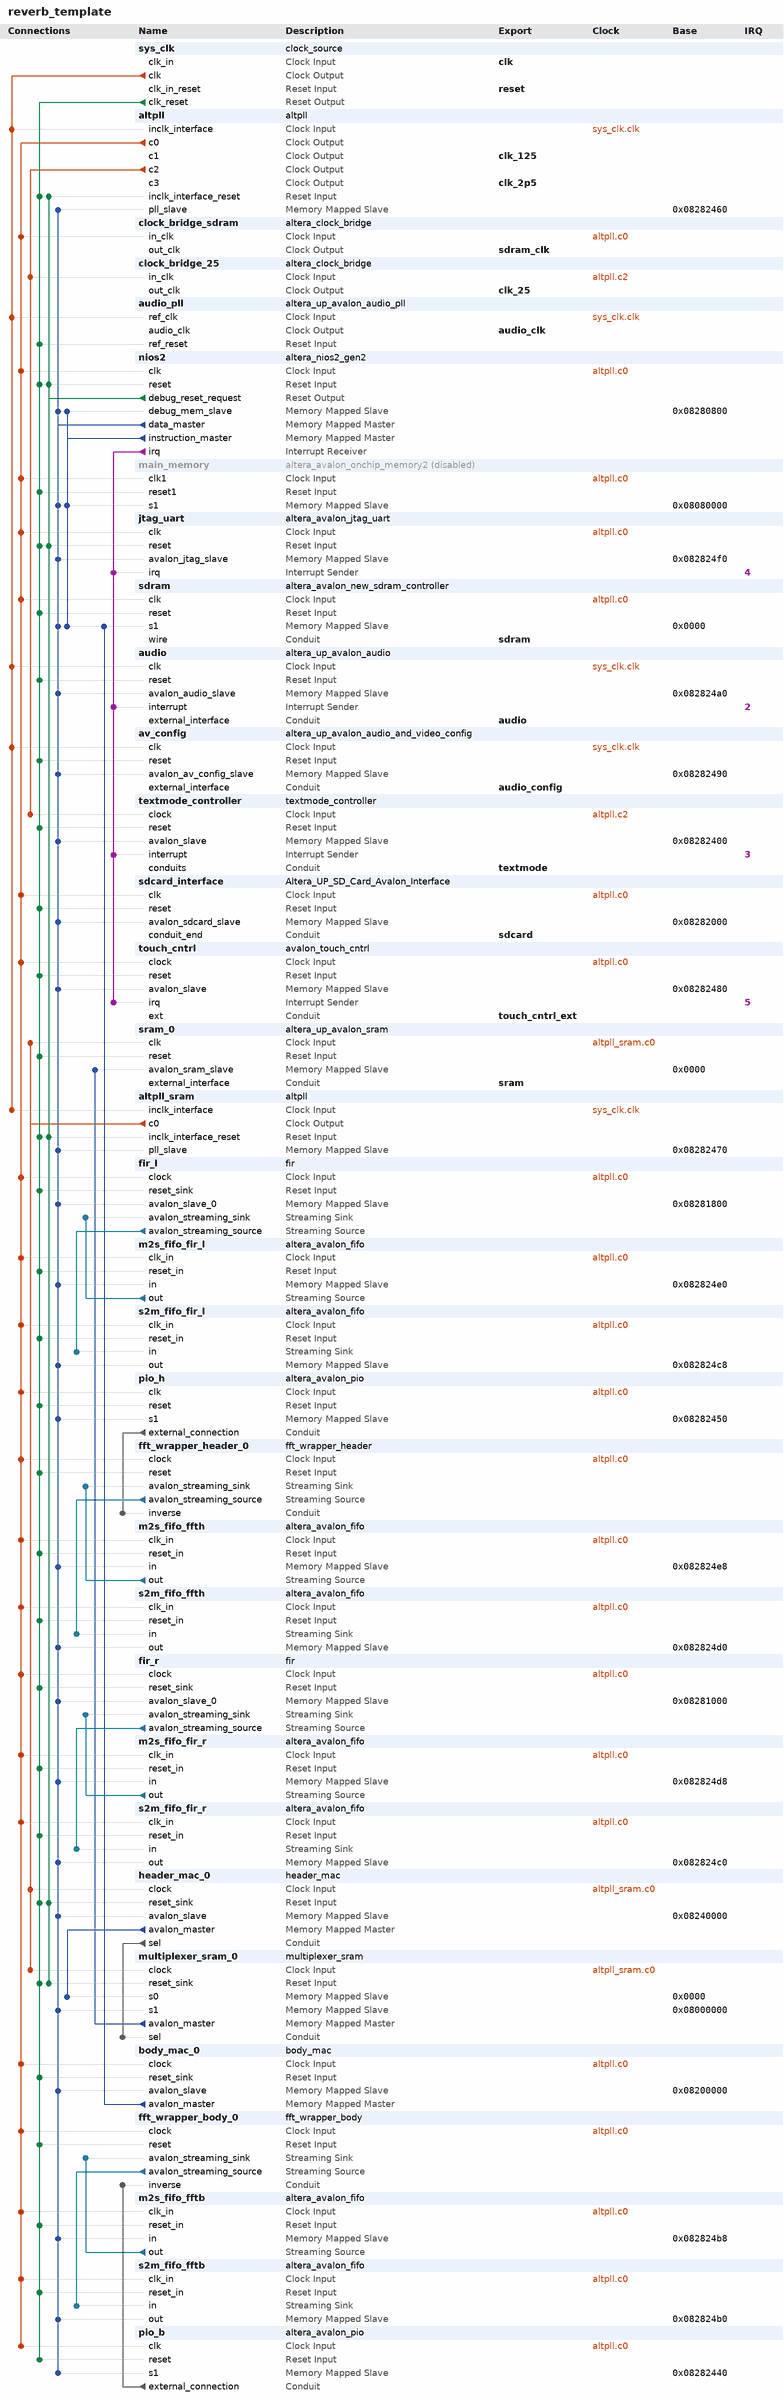
[diagram p0: system contents]
# Platform Designer (Qsys) system reverb_template, Cyclone IV E EP4CE115F29C7
# Parameters at their usual value, and those the tool derives, are not listed.
package require -exact qsys 18.1
create_system reverb_template
set_project_property DEVICE_FAMILY {Cyclone IV E}
set_project_property DEVICE EP4CE115F29C7

add_instance sys_clk clock_source 18.1
set_instance_parameter_value sys_clk clockFrequency 50000000

add_instance altpll altpll 18.1
set_instance_parameter_value altpll CLK0_DIVIDE_BY 1
set_instance_parameter_value altpll CLK0_MULTIPLY_BY 2
set_instance_parameter_value altpll CLK1_DIVIDE_BY 2
set_instance_parameter_value altpll CLK1_DUTY_CYCLE 50
set_instance_parameter_value altpll CLK1_MULTIPLY_BY 5
set_instance_parameter_value altpll CLK1_PHASE_SHIFT 0
set_instance_parameter_value altpll CLK2_DIVIDE_BY 2
set_instance_parameter_value altpll CLK2_DUTY_CYCLE 50
set_instance_parameter_value altpll CLK2_MULTIPLY_BY 1
set_instance_parameter_value altpll CLK2_PHASE_SHIFT 0
set_instance_parameter_value altpll CLK3_DIVIDE_BY 20
set_instance_parameter_value altpll CLK3_DUTY_CYCLE 50
set_instance_parameter_value altpll CLK3_MULTIPLY_BY 1
set_instance_parameter_value altpll CLK3_PHASE_SHIFT 0
set_instance_parameter_value altpll INCLK0_INPUT_FREQUENCY 20000
set_instance_parameter_value altpll PORT_ARESET PORT_UNUSED
set_instance_parameter_value altpll PORT_LOCKED PORT_UNUSED
set_instance_parameter_value altpll PORT_clk1 PORT_USED
set_instance_parameter_value altpll PORT_clk2 PORT_USED
set_instance_parameter_value altpll PORT_clk3 PORT_USED

add_instance clock_bridge_sdram altera_clock_bridge 18.1
set_instance_parameter_value clock_bridge_sdram DERIVED_CLOCK_RATE 100000000
set_instance_parameter_value clock_bridge_sdram EXPLICIT_CLOCK_RATE 0

add_instance clock_bridge_25 altera_clock_bridge 18.1
set_instance_parameter_value clock_bridge_25 DERIVED_CLOCK_RATE 25000000
set_instance_parameter_value clock_bridge_25 EXPLICIT_CLOCK_RATE 0

add_instance audio_pll altera_up_avalon_audio_pll 18.0
set_instance_parameter_value audio_pll gui_refclk 50.0

add_instance nios2 altera_nios2_gen2 18.1
set_instance_parameter_value nios2 dcache_size 0
set_instance_parameter_value nios2 exceptionSlave sdram.s1
set_instance_parameter_value nios2 icache_size 2048
set_instance_parameter_value nios2 impl Fast
set_instance_parameter_value nios2 resetSlave sdram.s1
set_instance_parameter_value nios2 resetrequest_enabled false

add_instance main_memory altera_avalon_onchip_memory2 18.1
set_instance_property main_memory ENABLED false
set_instance_parameter_value main_memory dataWidth 32
set_instance_parameter_value main_memory dualPort false
set_instance_parameter_value main_memory initMemContent true
set_instance_parameter_value main_memory initializationFileName onchip_mem.hex
set_instance_parameter_value main_memory memorySize 407200

add_instance jtag_uart altera_avalon_jtag_uart 18.1
set_instance_parameter_value jtag_uart simInteractiveOptions NO_INTERACTIVE_WINDOWS

add_instance sdram altera_avalon_new_sdram_controller 18.1
set_instance_parameter_value sdram TAC 5.5
set_instance_parameter_value sdram TRCD 20.0
set_instance_parameter_value sdram TRP 20.0
set_instance_parameter_value sdram casLatency 3
set_instance_parameter_value sdram columnWidth 10
set_instance_parameter_value sdram dataWidth 32
set_instance_parameter_value sdram generateSimulationModel true
set_instance_parameter_value sdram model single_Micron_MT48LC4M32B2_7_chip
set_instance_parameter_value sdram numberOfBanks 4
set_instance_parameter_value sdram numberOfChipSelects 1
set_instance_parameter_value sdram powerUpDelay 100.0
set_instance_parameter_value sdram refreshPeriod 15.625
set_instance_parameter_value sdram rowWidth 13

add_instance audio altera_up_avalon_audio 18.0
set_instance_parameter_value audio audio_in true
set_instance_parameter_value audio avalon_bus_type {Memory Mapped}
set_instance_parameter_value audio dw 32

add_instance av_config altera_up_avalon_audio_and_video_config 18.0
set_instance_parameter_value av_config audio_in {Line In to ADC}
set_instance_parameter_value av_config bit_length 24
set_instance_parameter_value av_config board DE2-115
set_instance_parameter_value av_config line_in_bypass false
set_instance_parameter_value av_config sampling_rate {48 kHz}

add_instance textmode_controller textmode_controller 1.0
set_instance_parameter_value textmode_controller CLK_FREQ 25000000
set_instance_parameter_value textmode_controller COLUMN_COUNT 100
set_instance_parameter_value textmode_controller ROW_COUNT 30

add_instance sdcard_interface Altera_UP_SD_Card_Avalon_Interface 18.0

add_instance touch_cntrl avalon_touch_cntrl 1.0
set_instance_parameter_value touch_cntrl SYS_CLK 100000000

add_instance sram_0 altera_up_avalon_sram 18.0
set_instance_parameter_value sram_0 board DE2-115
set_instance_parameter_value sram_0 pixel_buffer false

add_instance altpll_sram altpll 18.1
set_instance_parameter_value altpll_sram CLK0_DIVIDE_BY 2
set_instance_parameter_value altpll_sram CLK0_MULTIPLY_BY 3
set_instance_parameter_value altpll_sram INCLK0_INPUT_FREQUENCY 20000
set_instance_parameter_value altpll_sram PORT_ARESET PORT_UNUSED
set_instance_parameter_value altpll_sram PORT_LOCKED PORT_UNUSED
set_instance_parameter_value altpll_sram PORT_clk1 PORT_UNUSED
set_instance_parameter_value altpll_sram PORT_clk2 PORT_UNUSED
set_instance_parameter_value altpll_sram PORT_clk3 PORT_UNUSED

add_instance fir_l fir 1.0
set_instance_parameter_value fir_l ADDR_WIDTH 9
set_instance_parameter_value fir_l DATA_WIDTH 32
set_instance_parameter_value fir_l NUM_COEFFICIENTS 512

add_instance m2s_fifo_fir_l altera_avalon_fifo 18.1
set_instance_parameter_value m2s_fifo_fir_l bitsPerSymbol 32
set_instance_parameter_value m2s_fifo_fir_l channelWidth 0
set_instance_parameter_value m2s_fifo_fir_l errorWidth 0
set_instance_parameter_value m2s_fifo_fir_l fifoDepth 32
set_instance_parameter_value m2s_fifo_fir_l fifoInputInterfaceOptions AVALONMM_WRITE
set_instance_parameter_value m2s_fifo_fir_l fifoOutputInterfaceOptions AVALONST_SOURCE
set_instance_parameter_value m2s_fifo_fir_l singleClockMode true
set_instance_parameter_value m2s_fifo_fir_l symbolsPerBeat 1
set_instance_parameter_value m2s_fifo_fir_l useIRQ false
set_instance_parameter_value m2s_fifo_fir_l usePacket false
set_instance_parameter_value m2s_fifo_fir_l useReadControl false
set_instance_parameter_value m2s_fifo_fir_l useRegister true
set_instance_parameter_value m2s_fifo_fir_l useWriteControl false

add_instance s2m_fifo_fir_l altera_avalon_fifo 18.1
set_instance_parameter_value s2m_fifo_fir_l bitsPerSymbol 32
set_instance_parameter_value s2m_fifo_fir_l channelWidth 0
set_instance_parameter_value s2m_fifo_fir_l errorWidth 0
set_instance_parameter_value s2m_fifo_fir_l fifoDepth 32
set_instance_parameter_value s2m_fifo_fir_l fifoInputInterfaceOptions AVALONST_SINK
set_instance_parameter_value s2m_fifo_fir_l fifoOutputInterfaceOptions AVALONMM_READ
set_instance_parameter_value s2m_fifo_fir_l singleClockMode true
set_instance_parameter_value s2m_fifo_fir_l symbolsPerBeat 1
set_instance_parameter_value s2m_fifo_fir_l useIRQ false
set_instance_parameter_value s2m_fifo_fir_l usePacket false
set_instance_parameter_value s2m_fifo_fir_l useReadControl false
set_instance_parameter_value s2m_fifo_fir_l useRegister true
set_instance_parameter_value s2m_fifo_fir_l useWriteControl false

add_instance pio_h altera_avalon_pio 18.1
set_instance_parameter_value pio_h direction Output
set_instance_parameter_value pio_h width 1

add_instance fft_wrapper_header_0 fft_wrapper_header 1.0

add_instance m2s_fifo_ffth altera_avalon_fifo 18.1
set_instance_parameter_value m2s_fifo_ffth bitsPerSymbol 32
set_instance_parameter_value m2s_fifo_ffth channelWidth 0
set_instance_parameter_value m2s_fifo_ffth errorWidth 0
set_instance_parameter_value m2s_fifo_ffth fifoDepth 64
set_instance_parameter_value m2s_fifo_ffth fifoInputInterfaceOptions AVALONMM_WRITE
set_instance_parameter_value m2s_fifo_ffth fifoOutputInterfaceOptions AVALONST_SOURCE
set_instance_parameter_value m2s_fifo_ffth singleClockMode true
set_instance_parameter_value m2s_fifo_ffth symbolsPerBeat 1
set_instance_parameter_value m2s_fifo_ffth useIRQ false
set_instance_parameter_value m2s_fifo_ffth usePacket false
set_instance_parameter_value m2s_fifo_ffth useReadControl false
set_instance_parameter_value m2s_fifo_ffth useRegister true
set_instance_parameter_value m2s_fifo_ffth useWriteControl false

add_instance s2m_fifo_ffth altera_avalon_fifo 18.1
set_instance_parameter_value s2m_fifo_ffth bitsPerSymbol 32
set_instance_parameter_value s2m_fifo_ffth channelWidth 0
set_instance_parameter_value s2m_fifo_ffth errorWidth 0
set_instance_parameter_value s2m_fifo_ffth fifoDepth 64
set_instance_parameter_value s2m_fifo_ffth fifoInputInterfaceOptions AVALONST_SINK
set_instance_parameter_value s2m_fifo_ffth fifoOutputInterfaceOptions AVALONMM_READ
set_instance_parameter_value s2m_fifo_ffth singleClockMode true
set_instance_parameter_value s2m_fifo_ffth symbolsPerBeat 1
set_instance_parameter_value s2m_fifo_ffth useIRQ false
set_instance_parameter_value s2m_fifo_ffth usePacket false
set_instance_parameter_value s2m_fifo_ffth useReadControl false
set_instance_parameter_value s2m_fifo_ffth useRegister true
set_instance_parameter_value s2m_fifo_ffth useWriteControl false

add_instance fir_r fir 1.0
set_instance_parameter_value fir_r ADDR_WIDTH 9
set_instance_parameter_value fir_r DATA_WIDTH 32
set_instance_parameter_value fir_r NUM_COEFFICIENTS 512

add_instance m2s_fifo_fir_r altera_avalon_fifo 18.1
set_instance_parameter_value m2s_fifo_fir_r bitsPerSymbol 32
set_instance_parameter_value m2s_fifo_fir_r channelWidth 0
set_instance_parameter_value m2s_fifo_fir_r errorWidth 0
set_instance_parameter_value m2s_fifo_fir_r fifoDepth 32
set_instance_parameter_value m2s_fifo_fir_r fifoInputInterfaceOptions AVALONMM_WRITE
set_instance_parameter_value m2s_fifo_fir_r fifoOutputInterfaceOptions AVALONST_SOURCE
set_instance_parameter_value m2s_fifo_fir_r singleClockMode true
set_instance_parameter_value m2s_fifo_fir_r symbolsPerBeat 1
set_instance_parameter_value m2s_fifo_fir_r useIRQ false
set_instance_parameter_value m2s_fifo_fir_r usePacket false
set_instance_parameter_value m2s_fifo_fir_r useReadControl false
set_instance_parameter_value m2s_fifo_fir_r useRegister true
set_instance_parameter_value m2s_fifo_fir_r useWriteControl false

add_instance s2m_fifo_fir_r altera_avalon_fifo 18.1
set_instance_parameter_value s2m_fifo_fir_r bitsPerSymbol 32
set_instance_parameter_value s2m_fifo_fir_r channelWidth 0
set_instance_parameter_value s2m_fifo_fir_r errorWidth 0
set_instance_parameter_value s2m_fifo_fir_r fifoDepth 32
set_instance_parameter_value s2m_fifo_fir_r fifoInputInterfaceOptions AVALONST_SINK
set_instance_parameter_value s2m_fifo_fir_r fifoOutputInterfaceOptions AVALONMM_READ
set_instance_parameter_value s2m_fifo_fir_r singleClockMode true
set_instance_parameter_value s2m_fifo_fir_r symbolsPerBeat 1
set_instance_parameter_value s2m_fifo_fir_r useIRQ false
set_instance_parameter_value s2m_fifo_fir_r usePacket false
set_instance_parameter_value s2m_fifo_fir_r useReadControl false
set_instance_parameter_value s2m_fifo_fir_r useRegister true
set_instance_parameter_value s2m_fifo_fir_r useWriteControl false

add_instance header_mac_0 header_mac 1.0

add_instance multiplexer_sram_0 multiplexer_sram 1.0

add_instance body_mac_0 body_mac 1.0

add_instance fft_wrapper_body_0 fft_wrapper_body 1.0

add_instance m2s_fifo_fftb altera_avalon_fifo 18.1
set_instance_parameter_value m2s_fifo_fftb bitsPerSymbol 32
set_instance_parameter_value m2s_fifo_fftb channelWidth 0
set_instance_parameter_value m2s_fifo_fftb errorWidth 0
set_instance_parameter_value m2s_fifo_fftb fifoDepth 64
set_instance_parameter_value m2s_fifo_fftb fifoInputInterfaceOptions AVALONMM_WRITE
set_instance_parameter_value m2s_fifo_fftb fifoOutputInterfaceOptions AVALONST_SOURCE
set_instance_parameter_value m2s_fifo_fftb singleClockMode true
set_instance_parameter_value m2s_fifo_fftb symbolsPerBeat 1
set_instance_parameter_value m2s_fifo_fftb useIRQ false
set_instance_parameter_value m2s_fifo_fftb usePacket false
set_instance_parameter_value m2s_fifo_fftb useReadControl false
set_instance_parameter_value m2s_fifo_fftb useRegister true
set_instance_parameter_value m2s_fifo_fftb useWriteControl false

add_instance s2m_fifo_fftb altera_avalon_fifo 18.1
set_instance_parameter_value s2m_fifo_fftb bitsPerSymbol 32
set_instance_parameter_value s2m_fifo_fftb channelWidth 0
set_instance_parameter_value s2m_fifo_fftb errorWidth 0
set_instance_parameter_value s2m_fifo_fftb fifoDepth 64
set_instance_parameter_value s2m_fifo_fftb fifoInputInterfaceOptions AVALONST_SINK
set_instance_parameter_value s2m_fifo_fftb fifoOutputInterfaceOptions AVALONMM_READ
set_instance_parameter_value s2m_fifo_fftb singleClockMode true
set_instance_parameter_value s2m_fifo_fftb symbolsPerBeat 1
set_instance_parameter_value s2m_fifo_fftb useIRQ false
set_instance_parameter_value s2m_fifo_fftb usePacket false
set_instance_parameter_value s2m_fifo_fftb useReadControl false
set_instance_parameter_value s2m_fifo_fftb useRegister true
set_instance_parameter_value s2m_fifo_fftb useWriteControl false

add_instance pio_b altera_avalon_pio 18.1
set_instance_parameter_value pio_b direction Output
set_instance_parameter_value pio_b width 1

# connections
add_connection altpll.c0 body_mac_0.clock clock
add_connection altpll.c0 clock_bridge_sdram.in_clk clock
add_connection altpll.c0 fft_wrapper_body_0.clock clock
add_connection altpll.c0 fft_wrapper_header_0.clock clock
add_connection altpll.c0 fir_l.clock clock
add_connection altpll.c0 fir_r.clock clock
add_connection altpll.c0 jtag_uart.clk clock
add_connection altpll.c0 m2s_fifo_fftb.clk_in clock
add_connection altpll.c0 m2s_fifo_ffth.clk_in clock
add_connection altpll.c0 m2s_fifo_fir_l.clk_in clock
add_connection altpll.c0 m2s_fifo_fir_r.clk_in clock
add_connection altpll.c0 main_memory.clk1 clock
add_connection altpll.c0 nios2.clk clock
add_connection altpll.c0 pio_b.clk clock
add_connection altpll.c0 pio_h.clk clock
add_connection altpll.c0 s2m_fifo_fftb.clk_in clock
add_connection altpll.c0 s2m_fifo_ffth.clk_in clock
add_connection altpll.c0 s2m_fifo_fir_l.clk_in clock
add_connection altpll.c0 s2m_fifo_fir_r.clk_in clock
add_connection altpll.c0 sdcard_interface.clk clock
add_connection altpll.c0 sdram.clk clock
add_connection altpll.c0 touch_cntrl.clock clock
add_connection altpll.c2 clock_bridge_25.in_clk clock
add_connection altpll.c2 textmode_controller.clock clock
add_connection altpll_sram.c0 header_mac_0.clock clock
add_connection altpll_sram.c0 multiplexer_sram_0.clock clock
add_connection altpll_sram.c0 sram_0.clk clock
add_connection sys_clk.clk altpll.inclk_interface clock
add_connection sys_clk.clk altpll_sram.inclk_interface clock
add_connection sys_clk.clk audio.clk clock
add_connection sys_clk.clk audio_pll.ref_clk clock
add_connection sys_clk.clk av_config.clk clock
add_connection nios2.debug_reset_request altpll.inclk_interface_reset reset
add_connection nios2.debug_reset_request altpll_sram.inclk_interface_reset reset
add_connection nios2.debug_reset_request header_mac_0.reset_sink reset
add_connection nios2.debug_reset_request jtag_uart.reset reset
add_connection nios2.debug_reset_request multiplexer_sram_0.reset_sink reset
add_connection nios2.debug_reset_request nios2.reset reset
add_connection sys_clk.clk_reset altpll.inclk_interface_reset reset
add_connection sys_clk.clk_reset altpll_sram.inclk_interface_reset reset
add_connection sys_clk.clk_reset audio.reset reset
add_connection sys_clk.clk_reset audio_pll.ref_reset reset
add_connection sys_clk.clk_reset av_config.reset reset
add_connection sys_clk.clk_reset body_mac_0.reset_sink reset
add_connection sys_clk.clk_reset fft_wrapper_body_0.reset reset
add_connection sys_clk.clk_reset fft_wrapper_header_0.reset reset
add_connection sys_clk.clk_reset fir_l.reset_sink reset
add_connection sys_clk.clk_reset fir_r.reset_sink reset
add_connection sys_clk.clk_reset header_mac_0.reset_sink reset
add_connection sys_clk.clk_reset jtag_uart.reset reset
add_connection sys_clk.clk_reset m2s_fifo_fftb.reset_in reset
add_connection sys_clk.clk_reset m2s_fifo_ffth.reset_in reset
add_connection sys_clk.clk_reset m2s_fifo_fir_l.reset_in reset
add_connection sys_clk.clk_reset m2s_fifo_fir_r.reset_in reset
add_connection sys_clk.clk_reset main_memory.reset1 reset
add_connection sys_clk.clk_reset multiplexer_sram_0.reset_sink reset
add_connection sys_clk.clk_reset nios2.reset reset
add_connection sys_clk.clk_reset pio_b.reset reset
add_connection sys_clk.clk_reset pio_h.reset reset
add_connection sys_clk.clk_reset s2m_fifo_fftb.reset_in reset
add_connection sys_clk.clk_reset s2m_fifo_ffth.reset_in reset
add_connection sys_clk.clk_reset s2m_fifo_fir_l.reset_in reset
add_connection sys_clk.clk_reset s2m_fifo_fir_r.reset_in reset
add_connection sys_clk.clk_reset sdcard_interface.reset reset
add_connection sys_clk.clk_reset sdram.reset reset
add_connection sys_clk.clk_reset sram_0.reset reset
add_connection sys_clk.clk_reset textmode_controller.reset reset
add_connection sys_clk.clk_reset touch_cntrl.reset reset
add_connection body_mac_0.avalon_master sdram.s1 avalon
set_connection_parameter_value body_mac_0.avalon_master/sdram.s1 baseAddress 0x0000
add_connection header_mac_0.avalon_master multiplexer_sram_0.s0 avalon
set_connection_parameter_value header_mac_0.avalon_master/multiplexer_sram_0.s0 baseAddress 0x0000
add_connection multiplexer_sram_0.avalon_master sram_0.avalon_sram_slave avalon
set_connection_parameter_value multiplexer_sram_0.avalon_master/sram_0.avalon_sram_slave baseAddress 0x0000
add_connection nios2.data_master altpll.pll_slave avalon
set_connection_parameter_value nios2.data_master/altpll.pll_slave baseAddress 0x08282460
add_connection nios2.data_master altpll_sram.pll_slave avalon
set_connection_parameter_value nios2.data_master/altpll_sram.pll_slave baseAddress 0x08282470
add_connection nios2.data_master audio.avalon_audio_slave avalon
set_connection_parameter_value nios2.data_master/audio.avalon_audio_slave baseAddress 0x082824a0
add_connection nios2.data_master av_config.avalon_av_config_slave avalon
set_connection_parameter_value nios2.data_master/av_config.avalon_av_config_slave baseAddress 0x08282490
add_connection nios2.data_master body_mac_0.avalon_slave avalon
set_connection_parameter_value nios2.data_master/body_mac_0.avalon_slave baseAddress 0x08200000
add_connection nios2.data_master fir_l.avalon_slave_0 avalon
set_connection_parameter_value nios2.data_master/fir_l.avalon_slave_0 baseAddress 0x08281800
add_connection nios2.data_master fir_r.avalon_slave_0 avalon
set_connection_parameter_value nios2.data_master/fir_r.avalon_slave_0 baseAddress 0x08281000
add_connection nios2.data_master header_mac_0.avalon_slave avalon
set_connection_parameter_value nios2.data_master/header_mac_0.avalon_slave baseAddress 0x08240000
add_connection nios2.data_master jtag_uart.avalon_jtag_slave avalon
set_connection_parameter_value nios2.data_master/jtag_uart.avalon_jtag_slave baseAddress 0x082824f0
add_connection nios2.data_master m2s_fifo_fftb.in avalon
set_connection_parameter_value nios2.data_master/m2s_fifo_fftb.in baseAddress 0x082824b8
add_connection nios2.data_master m2s_fifo_ffth.in avalon
set_connection_parameter_value nios2.data_master/m2s_fifo_ffth.in baseAddress 0x082824e8
add_connection nios2.data_master m2s_fifo_fir_l.in avalon
set_connection_parameter_value nios2.data_master/m2s_fifo_fir_l.in baseAddress 0x082824e0
add_connection nios2.data_master m2s_fifo_fir_r.in avalon
set_connection_parameter_value nios2.data_master/m2s_fifo_fir_r.in baseAddress 0x082824d8
add_connection nios2.data_master main_memory.s1 avalon
set_connection_parameter_value nios2.data_master/main_memory.s1 baseAddress 0x08080000
add_connection nios2.data_master multiplexer_sram_0.s1 avalon
set_connection_parameter_value nios2.data_master/multiplexer_sram_0.s1 baseAddress 0x08000000
add_connection nios2.data_master nios2.debug_mem_slave avalon
set_connection_parameter_value nios2.data_master/nios2.debug_mem_slave baseAddress 0x08280800
add_connection nios2.data_master pio_b.s1 avalon
set_connection_parameter_value nios2.data_master/pio_b.s1 baseAddress 0x08282440
add_connection nios2.data_master pio_h.s1 avalon
set_connection_parameter_value nios2.data_master/pio_h.s1 baseAddress 0x08282450
add_connection nios2.data_master s2m_fifo_fftb.out avalon
set_connection_parameter_value nios2.data_master/s2m_fifo_fftb.out baseAddress 0x082824b0
add_connection nios2.data_master s2m_fifo_ffth.out avalon
set_connection_parameter_value nios2.data_master/s2m_fifo_ffth.out baseAddress 0x082824d0
add_connection nios2.data_master s2m_fifo_fir_l.out avalon
set_connection_parameter_value nios2.data_master/s2m_fifo_fir_l.out baseAddress 0x082824c8
add_connection nios2.data_master s2m_fifo_fir_r.out avalon
set_connection_parameter_value nios2.data_master/s2m_fifo_fir_r.out baseAddress 0x082824c0
add_connection nios2.data_master sdcard_interface.avalon_sdcard_slave avalon
set_connection_parameter_value nios2.data_master/sdcard_interface.avalon_sdcard_slave baseAddress 0x08282000
add_connection nios2.data_master sdram.s1 avalon
set_connection_parameter_value nios2.data_master/sdram.s1 baseAddress 0x0000
add_connection nios2.data_master textmode_controller.avalon_slave avalon
set_connection_parameter_value nios2.data_master/textmode_controller.avalon_slave baseAddress 0x08282400
add_connection nios2.data_master touch_cntrl.avalon_slave avalon
set_connection_parameter_value nios2.data_master/touch_cntrl.avalon_slave baseAddress 0x08282480
add_connection nios2.instruction_master main_memory.s1 avalon
set_connection_parameter_value nios2.instruction_master/main_memory.s1 baseAddress 0x08080000
add_connection nios2.instruction_master nios2.debug_mem_slave avalon
set_connection_parameter_value nios2.instruction_master/nios2.debug_mem_slave baseAddress 0x08280800
add_connection nios2.instruction_master sdram.s1 avalon
set_connection_parameter_value nios2.instruction_master/sdram.s1 baseAddress 0x0000
add_connection fft_wrapper_body_0.avalon_streaming_source s2m_fifo_fftb.in avalon_streaming
add_connection fft_wrapper_header_0.avalon_streaming_source s2m_fifo_ffth.in avalon_streaming
add_connection fir_l.avalon_streaming_source s2m_fifo_fir_l.in avalon_streaming
add_connection fir_r.avalon_streaming_source s2m_fifo_fir_r.in avalon_streaming
add_connection m2s_fifo_fftb.out fft_wrapper_body_0.avalon_streaming_sink avalon_streaming
add_connection m2s_fifo_ffth.out fft_wrapper_header_0.avalon_streaming_sink avalon_streaming
add_connection m2s_fifo_fir_l.out fir_l.avalon_streaming_sink avalon_streaming
add_connection m2s_fifo_fir_r.out fir_r.avalon_streaming_sink avalon_streaming
add_connection header_mac_0.sel multiplexer_sram_0.sel conduit
add_connection pio_b.external_connection fft_wrapper_body_0.inverse conduit
add_connection pio_h.external_connection fft_wrapper_header_0.inverse conduit
add_connection nios2.irq audio.interrupt interrupt
set_connection_parameter_value nios2.irq/audio.interrupt irqNumber 2
add_connection nios2.irq jtag_uart.irq interrupt
set_connection_parameter_value nios2.irq/jtag_uart.irq irqNumber 4
add_connection nios2.irq textmode_controller.interrupt interrupt
set_connection_parameter_value nios2.irq/textmode_controller.interrupt irqNumber 3
add_connection nios2.irq touch_cntrl.irq interrupt
set_connection_parameter_value nios2.irq/touch_cntrl.irq irqNumber 5

# exported interfaces
add_interface audio conduit end
set_interface_property audio EXPORT_OF audio.external_interface
add_interface audio_clk clock source
set_interface_property audio_clk EXPORT_OF audio_pll.audio_clk
add_interface audio_config conduit end
set_interface_property audio_config EXPORT_OF av_config.external_interface
add_interface clk clock sink
set_interface_property clk EXPORT_OF sys_clk.clk_in
add_interface clk_125 clock source
set_interface_property clk_125 EXPORT_OF altpll.c1
add_interface clk_25 clock source
set_interface_property clk_25 EXPORT_OF clock_bridge_25.out_clk
add_interface clk_2p5 clock source
set_interface_property clk_2p5 EXPORT_OF altpll.c3
add_interface reset reset sink
set_interface_property reset EXPORT_OF sys_clk.clk_in_reset
add_interface sdcard conduit end
set_interface_property sdcard EXPORT_OF sdcard_interface.conduit_end
add_interface sdram conduit end
set_interface_property sdram EXPORT_OF sdram.wire
add_interface sdram_clk clock source
set_interface_property sdram_clk EXPORT_OF clock_bridge_sdram.out_clk
add_interface sram conduit end
set_interface_property sram EXPORT_OF sram_0.external_interface
add_interface textmode conduit end
set_interface_property textmode EXPORT_OF textmode_controller.conduits
add_interface touch_cntrl_ext conduit end
set_interface_property touch_cntrl_ext EXPORT_OF touch_cntrl.ext

set_interconnect_requirement {$system} qsys_mm.clockCrossingAdapter HANDSHAKE
set_interconnect_requirement {$system} qsys_mm.enableEccProtection FALSE
set_interconnect_requirement {$system} qsys_mm.insertDefaultSlave FALSE
set_interconnect_requirement {$system} qsys_mm.maxAdditionalLatency 1

save_system reverb_template.qsys
